# EAGLE design canboard (EAGLE 7.2.0)
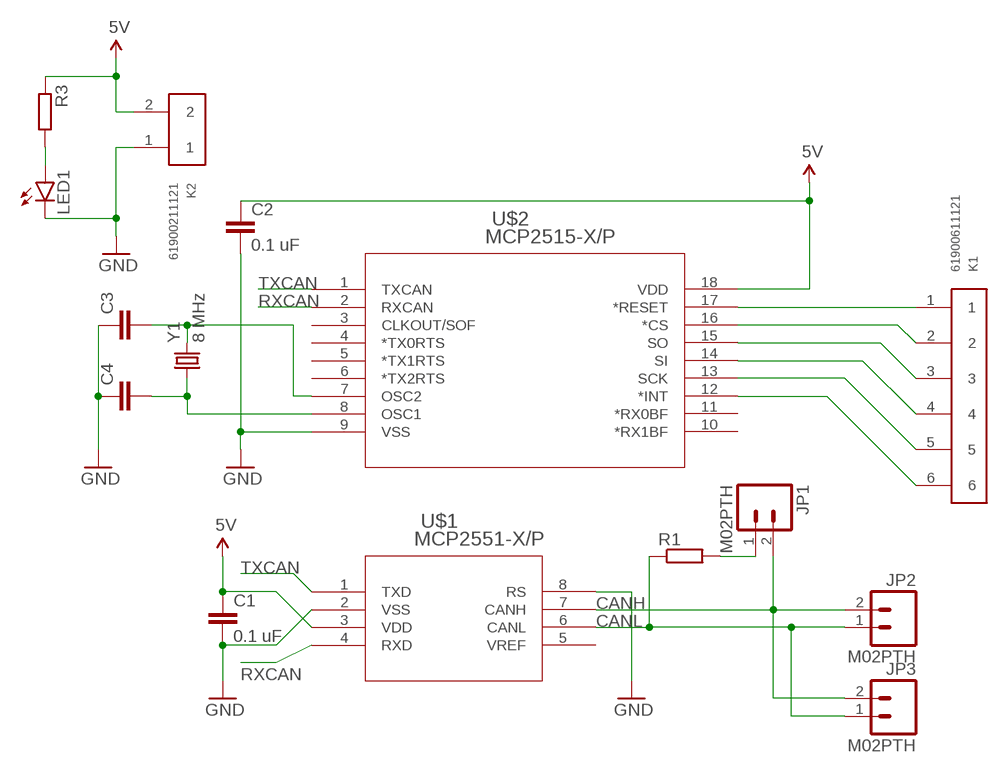
[diagram p0: schematic, sheet 1]

## Parts
C1  0.1 uF  C-EU050-030X075  [C050-030X075]
C2  0.1 uF  C-EU050-030X075  [C050-030X075]
C3  C-EU025-025X050  [C025-025X050]
C4  C-EU025-025X050  [C025-025X050]
JP1  M02PTH  [1X02]
JP2  M02PTH  [1X02]
JP3  M02PTH  [1X02]
K1  61900611121  [61900611121]
K2  61900211121  [61900211121]
LED1  LED3MM  [LED3MM]
R1  R-EU_0207/10  [0207/10]
R3  R-EU_0207/10  [0207/10]
U$1  MCP2551-X/P  [PDIP8_300MC]
U$2  MCP2515-X/P  [PDIP18_300MC]
Y1  8 MHz  CRYSTALHC49US  [HC49US]

## Nets
5V: C1.1 C2.1 K2.2 R3.1 U$1.3(VDD) U$2.18(VDD)
CANH: JP1.2 JP2.2 JP3.2 U$1.7(CANH)
CANL: JP2.1 JP3.1 R1.1 U$1.6(CANL)
GND: C1.2 C2.2 C3.1 C4.1 K2.1 LED1.K(C) U$1.2(VSS) U$1.8(RS) U$2.9(VSS)
N$1: C4.2 U$2.8(OSC1) Y1.1
N$2: C3.2 U$2.7(OSC2) Y1.2
N$3: K1.1 U$2.17(*RESET)
N$4: K1.2 U$2.16(*CS)
N$5: K1.3 U$2.15(SO)
N$6: K1.4 U$2.14(SI)
N$7: K1.5 U$2.13(SCK)
N$8: LED1.A R3.2
N$9: JP1.1 R1.2
N$10: K1.6 U$2.12(*INT)
RXCAN: U$1.4(RXD) U$2.2(RXCAN)
TXCAN: U$1.1(TXD) U$2.1(TXCAN)
Unconnected: U$1.5(VREF) U$2.3(CLKOUT/SOF) U$2.4(*TX0RTS) U$2.5(*TX1RTS) U$2.6(*TX2RTS) U$2.10(*RX1BF) U$2.11(*RX0BF)

## Library data of the parts
C1-C4 = rcl:C-EU: CAPACITOR, European symbol
JP1-JP3 = SparkFun-Connectors:M02: Standard 2-pin 0.1" header. Use with - straight break away headers ( PRT-00116) - right angle break away headers (PRT-00553) - swiss pins (PRT-00743) - machine pins (PRT-00117) - female headers (PRT-00115) Molex polarized connector foot print use with: PRT-08233 with associated crimp pins and housings. 2.54_SCREWTERM for use with PRT-10571. 3.5mm Screw Terminal footprints for PRT-08084 5mm Screw Terminal footprints for use with PRT-08432
K1 = EagleLibrary_Wuerth_Elektronik _eiCan_Wire_to_Board_Connectors_v6_20150113:61900611121: WR-WTB 2.54mm Male Locking Header, 6 Pins=>Code : Con_WTB_2.54_PCB_THT_61900611121 <http://katalog.we-online.de/media/thumbs2/eican/thb_Con_WTB_2.54_PCB_THT_6190xx11121_pf2.jpg> Details see: http://katalog.we-online.de/en/em/619_0xx_111_21 Created 2014-06-05, Karrer Zheng 2014 (C) Würth Elektronik
K2 = EagleLibrary_Wuerth_Elektronik _eiCan_Wire_to_Board_Connectors_v6_20150113:61900211121: WR-WTB 2.54mm Male Locking Header, 2 Pins=>Code : Con_WTB_2.54_PCB_THT_61900211121 <http://katalog.we-online.de/media/thumbs2/eican/thb_Con_WTB_2.54_PCB_THT_6190xx11121_pf2.jpg> Details see: http://katalog.we-online.de/en/em/619_0xx_111_21 Created 2014-06-05, Karrer Zheng 2014 (C) Würth Elektronik
LED1 = SparkFun-LED:LED: LEDs Standard schematic elements and footprints for 5mm, 3mm, 1206, and 0603 sized LEDs. 5mm - Spark Fun Electronics SKU : COM-00529 (and others)
R1 R3 = rcl:R-EU_: RESISTOR, European symbol
U$1 = Locker-custom:MCP2551-X/P
U$2 = Locker-custom:MCP2515-X/P
Y1 = SparkFun-FreqCtrl:CRYSTAL: Various standard crystals. Proven footprints.

## Net classes
0 default: width 0.381 mm, clearance 0.508 mm

## Board
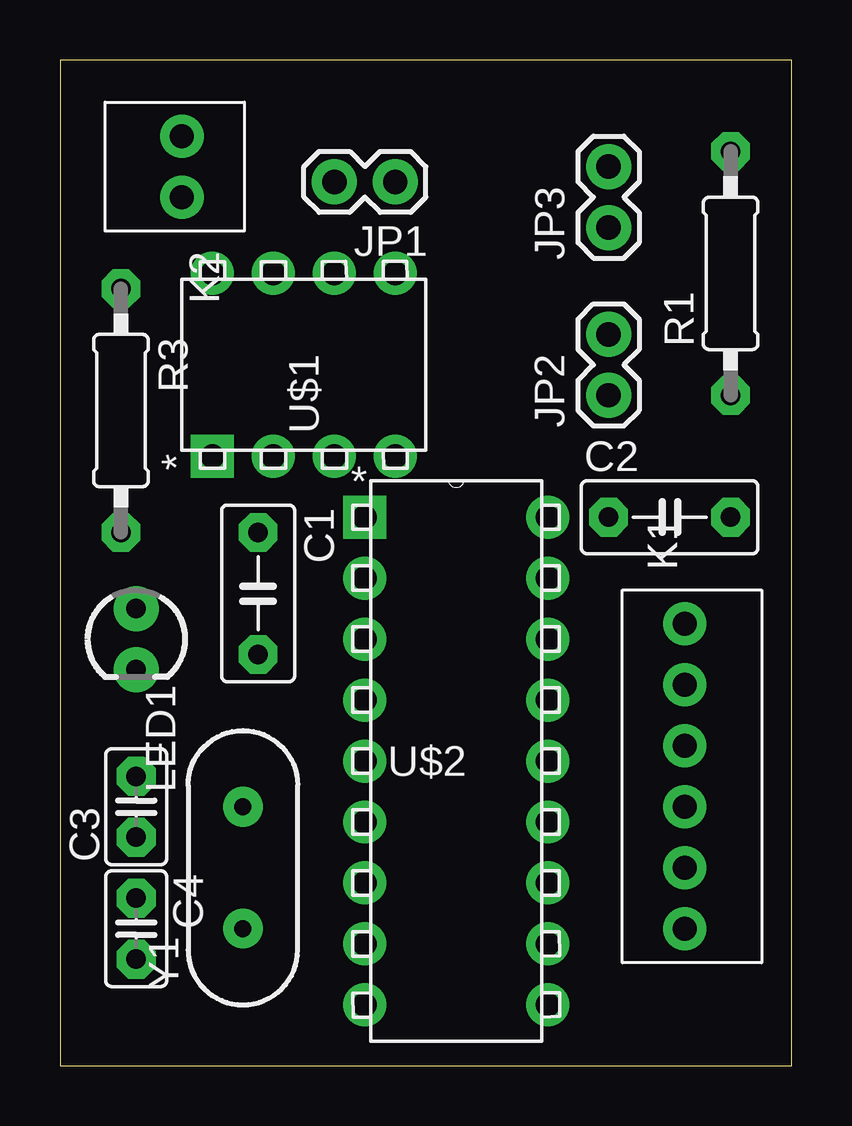
[diagram p1: board, top side]
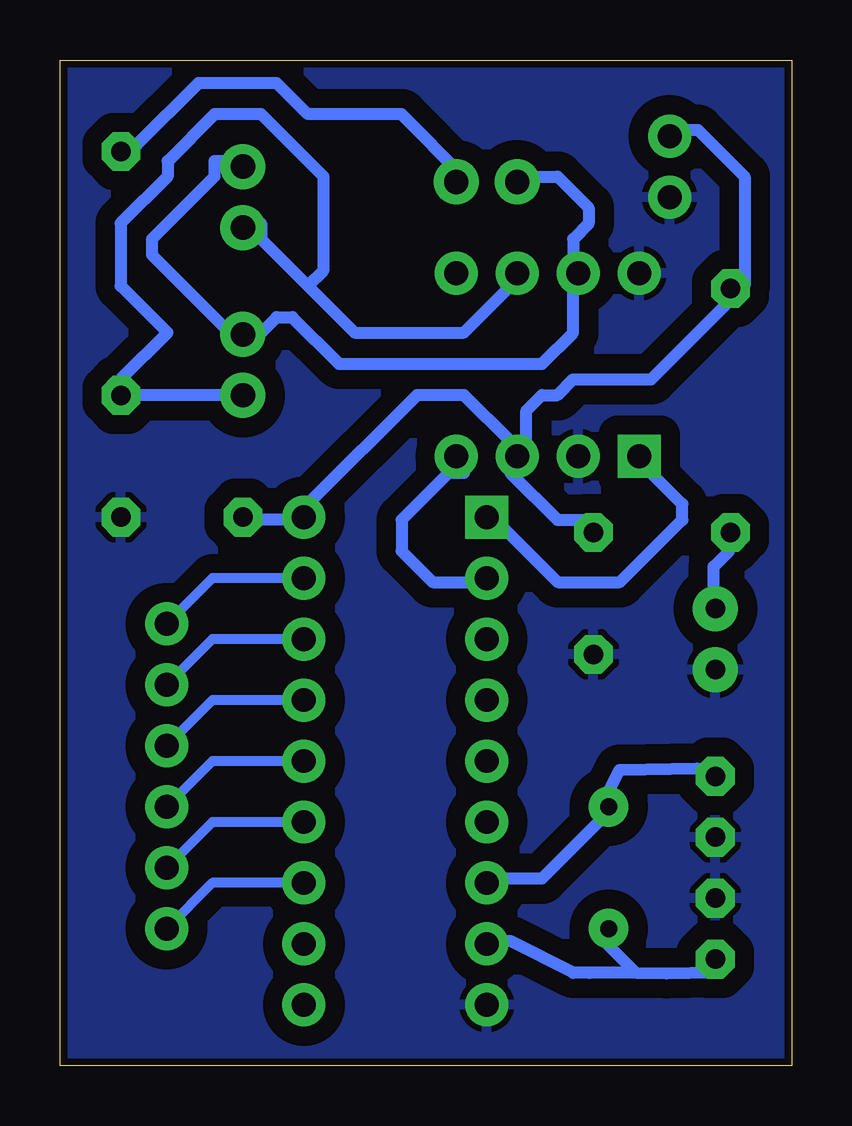
[diagram p2: board, bottom side, seen from below]

Size 30.48 x 41.91 mm. Coordinates in mm from the lower left corner, seen from the top.
Outline: 0,0 30.48,0 30.48,41.91 0,41.91 0,0
Copper layers (1*16): Top 0.035mm / dielectric 1.5mm / Bottom 0.035mm
Design rules "rw *": minimum track width 0.5mm, minimum drill 0.8mm, track to track 0.8mm, track to pad 0.8mm, pad to pad 0.45mm, via to via 0.8mm, smd to smd 8mil, copper to edge 10mil, drill to drill 8mil, minimum pad ring 0.4mm, minimum via ring 0.4mm, stop-mask expansion 0mil, vias tented up to drill 0mil, thermal gap 10mil

### Footprints (pad centres in the part's own frame; a part is rotated, then mirrored left to right if it is on the bottom)
C050-030X075 = drill 0.813 octagon: 1 -2.54,0; 2 2.54,0
C025-025X050 = drill 0.813 octagon: 1 -1.27,0; 2 1.27,0
1X02 = drill 1.016 pad 1.88: 1 0,0; 2 2.54,0
61900611121 = drill 1: 1 1.27,0; 2 -1.27,0; 3 -3.81,0; 4 -6.35,0; 5 -8.89,0; 6 -11.43,0
61900211121 = drill 1: 1 1.27,0; 2 -1.27,0
LED3MM = drill 0.813 pad 1.88: A -1.27,0; K 1.27,0
0207/10 = drill 0.813 octagon: 1 -5.08,0; 2 5.08,0
PDIP8_300MC = drill 0.991 square: 1 -7.62,7.62 | drill 0.991: 2 -7.62,5.08; 3 -7.62,2.54; 4 -7.62,0; 5 0,0; 6 0,2.54; 7 0,5.08; 8 0,7.62
PDIP18_300MC = drill 0.991 square: 1 -7.62,20.32 | drill 0.991: 2 -7.62,17.78; 3 -7.62,15.24; 4 -7.62,12.7; 5 -7.62,10.16; 6 -7.62,7.62; 7 -7.62,5.08; 8 -7.62,2.54; 9 -7.62,0; 10 0,0; 11 0,2.54; 12 0,5.08; 13 0,7.62; 14 0,10.16; 15 0,12.7; 16 0,15.24; 17 0,17.78; 18 0,20.32
HC49US = drill 0.7 pad 1.651: 1 -2.54,0; 2 2.54,0

### Placement (x,y rotation side)
C1  8.26,19.68 270 top
C2  25.4,22.86 0 top
C3  3.17,10.79 90 top
C4  3.17,5.71 270 top
JP1  13.97,36.83 180 top
JP2  22.86,27.94 90 top
JP3  22.86,34.92 90 top
K1  26.04,17.14 90 top
K2  5.08,37.47 270 top
LED1  3.17,17.78 270 top
R1  27.94,33.02 90 top
R3  2.54,27.3 270 top
U$1  13.97,33.02 90 top
U$2  20.32,2.54 0 top
Y1  7.62,8.26 90 top

### Tracks (layer width: path | path; a pad name or v marks a point on that pad's centre or on a via)
5V
  Bottom 0.5: K2.2 4.55,39 3.9,39 1.95,37.05 1.95,32.5 R3.1 2.6,31.85 5.85,28.6 9.1,28.6 9.75,27.95 10.4,27.95 11.05,27.3 11.05,26 U$1.3 | C2.1 22.75,22.75 20.8,22.75 U$2.18 20.15,23.4 15.6,27.95 13.65,27.95 11.7,26 U$1.3 | C1.1 8.45,22.75 9.75,22.75 11.7,24.7 11.7,25.35 U$1.3
CANH
  Bottom 0.5: JP1.2 11.05,37.05 9.75,37.05 8.45,35.75 8.45,35.1 9.1,34.45 9.1,33.15 U$1.7 9.1,32.5 9.1,30.55 10.4,29.25 18.85,29.25 20.8,31.2 21.45,31.2 22.1,30.55 22.75,30.55 JP2.2 23.4,30.55 26.65,33.8 26.65,34.45 24.05,37.05 24.05,37.7 23.4,37.7 JP3.2
CANL
  Bottom 0.5: JP2.1 23.4,27.95 25.36,27.95 27.3,27.95 R1.1 27.95,28.6 26,30.55 27.95,32.5 27.95,35.1 26,37.05 26,37.7 24.05,39.65 22.1,39.65 19.5,37.05 19.5,33.15 20.15,32.5 | 20.15,32.5 22.1,34.45 22.1,35.1 22.75,35.1 JP3.1 | 20.15,32.5 18.2,30.55 13.65,30.55 11.7,32.5 U$1.6
GND
  pour Bottom (isolate 0.305): 0,41.91 30.48,41.91 30.48,0 0,0
N$1
  Bottom 0.5: 6.5,3.88 7.17,4.55 7.8,5.2 Y1.1 | 6.5,3.88 5.2,3.85 3.25,3.9 C4.2 | 6.5,3.88 8.42,3.87 9.1,3.87 11.7,5.2 12.35,5.2 U$2.8
N$2
  Bottom 0.5: C3.2 3.25,12.35 3.93,12.39 7.17,12.34 7.8,11.05 Y1.2 7.8,10.4 10.4,7.8 12.35,7.8 U$2.7
N$3
  Bottom 0.406: U$2.17 24.13,20.32 K1.1
N$4
  Bottom 0.406: U$2.16 24.13,17.78 K1.2
N$5
  Bottom 0.406: 24.42,14.95 K1.3 24.13,15.24 U$2.15
N$6
  Bottom 0.406: U$2.14 24.13,12.7 K1.4
N$7
  Bottom 0.406: U$2.13 24.13,10.16 K1.5
N$8
  Bottom 0.5: R3.2 2.6,22.1 2.6,21.45 3.25,20.8 3.25,19.5 LED1.A
N$9
  Bottom 0.5: R1.2 27.3,38.35 24.7,40.95 21.45,40.95 20.15,39.65 16.25,39.65 13.65,37.05 JP1.1
N$10
  Bottom 0.406: U$2.12 24.13,7.62 K1.6
RXCAN
  Bottom 0.5: U$2.2 13,20.15 14.95,20.15 16.25,21.45 16.25,22.75 14.3,24.7 13.65,24.7 13.65,25.35 U$1.4
TXCAN
  Bottom 0.5: U$1.1 5.85,25.35 5.85,24.7 4.55,23.4 4.55,22.75 7.15,20.15 9.75,20.15 12.35,22.75 U$2.1